# Altium schematic sheet USB.SchDoc: USB_Charger
size A4; Author: Sajitha Madugalle; Revision: 1; SheetNumber: 5; SheetTotal: 7
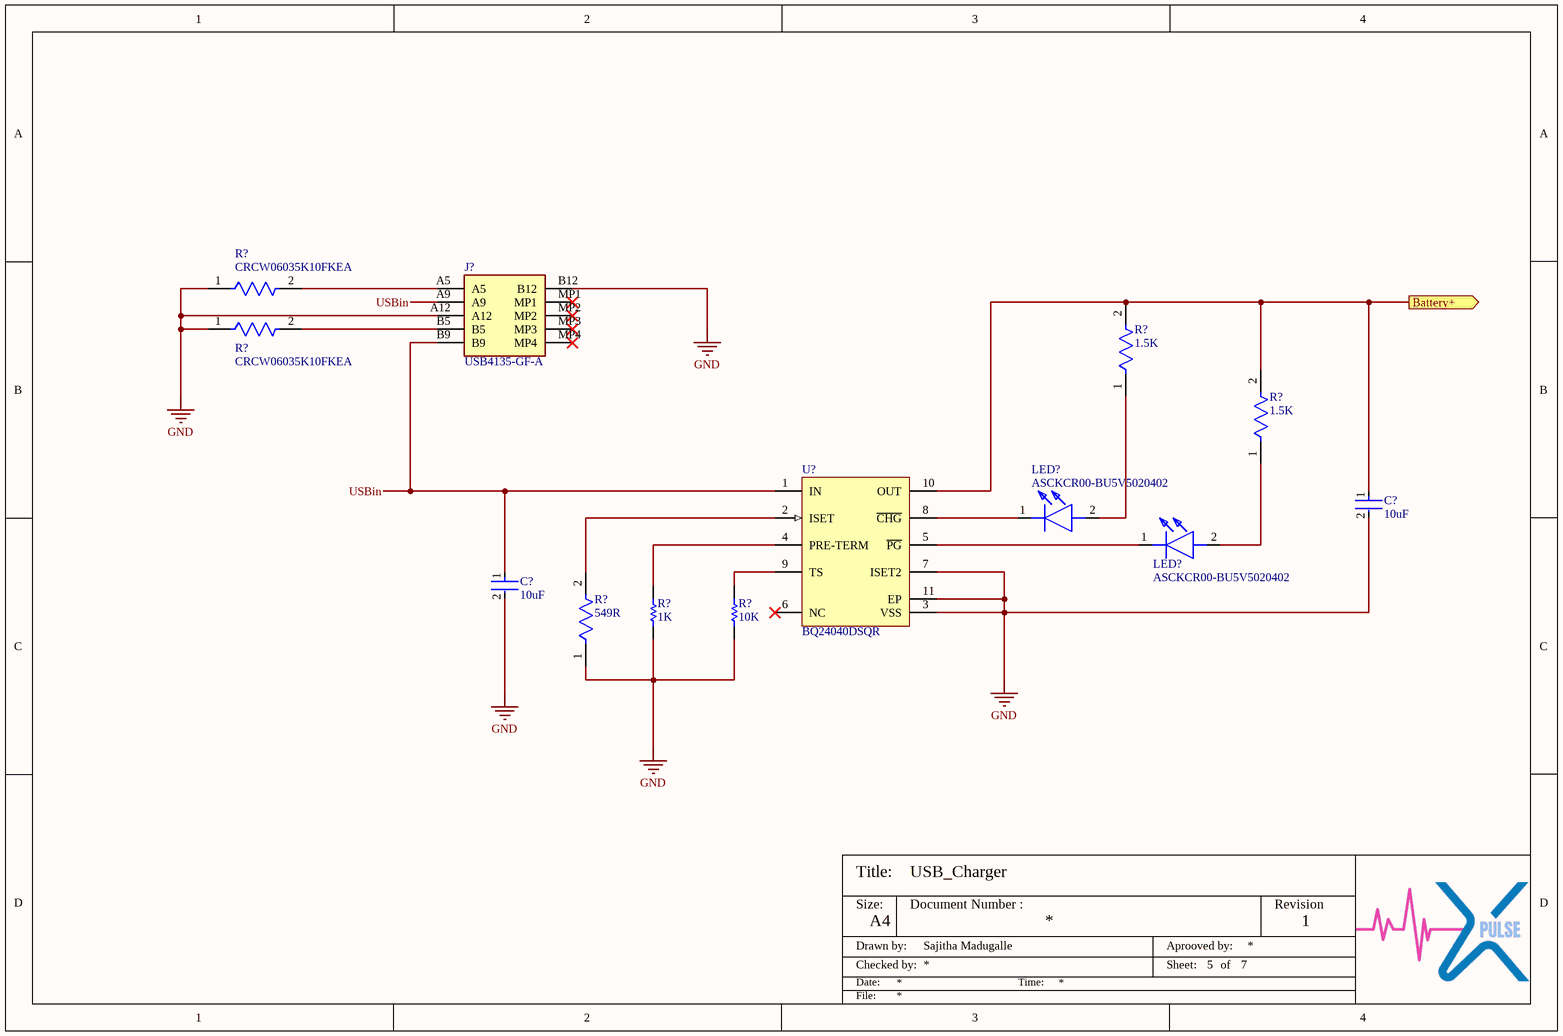
[diagram p0: USB.SchDoc]

## Parts
(Parts that share a designator on the sheet are numbered #1, #2 ... from top to bottom, then left to right.)
C?#1  10uF  [FP-CL10-IPC_A]
C?#2  10uF  [FP-CL10-IPC_A]
J?  USB4135-GF-A  [USB4135GFA]
LED?#1  ASCKCR00-BU5V5020402  [ASCKCR00BU5V5020402]
LED?#2  ASCKCR00-BU5V5020402  [ASCKCR00BU5V5020402]
R?#1  CRCW06035K10FKEA  [FP-CRCW0603-e3-IPC_C]
R?#2  CRCW06035K10FKEA  [FP-CRCW0603-e3-IPC_C]
R?#3  1.5K  [FP-CRCW0603-e3-IPC_A]
R?#4  1.5K  [FP-CRCW0603-e3-IPC_A]
R?#5  1K  [RESC1609X50X30NL8T20]
R?#6  10K  [RESC1609X50X30NL8T20]
R?#7  549R  [FP-CRCW0603-e3-IPC_B]
U?  BQ24040DSQR  [DSQ0010A_V]

## Ports
Battery+ (out)

## Nets
GND: C?#1.2 C?#2.2 J?.A12 J?.B12 R?#1.1 R?#2.1 R?#5.1 R?#6.1 R?#7.1 U?.3(VSS) U?.7(ISET2) U?.11(EP)
Battery+: C?#1.1 R?#3.2 R?#4.2 U?.10(OUT) ; port Battery+
USBin: C?#2.1 J?.A9 J?.B9 U?.1(IN)
NetJ?_A5: J?.A5 R?#1.2
NetJ?_B5: J?.B5 R?#2.2
NetLED?#1_1: LED?#1.1(K) U?.8(~{CHG})
NetLED?#1_2: LED?#1.2(A) R?#3.1
NetLED?#2_1: LED?#2.1(K) U?.5(~{PG})
NetLED?#2_2: LED?#2.2(A) R?#4.1
NetR?#5_2: R?#5.2 U?.4(PRE-TERM)
NetR?#6_2: R?#6.2 U?.9(TS)
NetR?#7_2: R?#7.2 U?.2(ISET)

Not connected (* = marked no-connect by the designer): J? MP1* MP2* MP3* MP4*; U? 6(NC)*

## Notes on the sheet
- Title:
- Size:
- Document Number :
- Revision
- Drawn by:
- Checked by:
- Date:
- A4
- Time:
- Aprooved by:
- Sheet:
- of
- File:

## Library data of the parts
C?#1 C?#2 = CMP-13271-000587-1: Cap Ceramic 100nF 50V X7R ±10% Pad SMD 0603 +125°C T/R; Case/Package: 0603; Depth: 0.8mm; Max Operating Temperature: 125°C; Lead Free: Lead Free; Material: Ceramic; Voltage Rating: 50V; Min Operating Temperature: -55°C; Voltage Rating (DC): 50V; Dielectric: X7R; Height: 0.8mm; Capacitance: 100nF; Thickness: 0.035inch; Radiation Hardening: No; Voltage: 50V; Packaging: Tape and Reel; Length: 1.6mm; Tolerance: 10%; Width: 0.031inch; Mount: Surface Mount; Package Quantity: 10000
J? = USB4135-GF-A: Connector; Manufacturer_Name: GCT (GLOBAL CONNECTOR TECHNOLOGY); Datasheet Link: https://ar.mouser.com/datasheet/2/837/usb4135-2930399.pdf; Height: 3.5mm; Manufacturer_Part_Number: USB4135-GF-A; Mouser Part Number: 640-USB4135-GF-A; Mouser Price/Stock: https://www.mouser.co.uk/ProductDetail/GCT/USB4135-GF-A?qs=Li%252BoUPsLEnt6HRo6RUvaXA%3D%3D
LED?#1 LED?#2 = ASCKCR00-BU5V5020402: LED; Manufacturer_Name: Avago Technologies; Datasheet Link: https://docs.broadcom.com/doc/ASCKCx00-xxxxx0x0x02-DS; Height: 0.75mm; Manufacturer_Part_Number: ASCKCR00-BU5V5020402; Mouser Part Number: 630-ASCKCR00BU5V5020; Mouser Price/Stock: https://www.mouser.co.uk/ProductDetail/Broadcom-Avago/ASCKCR00-BU5V5020402?qs=OcgtsXO%252B3gu355%2FiA8jcWA%3D%3D
R?#1 R?#2 = CMP-1012-00590-3: RES Thick Film, 5.1kΩ, 1%, 0.1W, 100ppm/°C, 0603; Power Rating: 100mW; Voltage Rating (DC): 75V; Resistance: 5.1kR; Width: 0.85mm; Depth: 0.85mm; Military Standard: Not; Package Quantity: 5000; Case Code (Metric): 1608; Length: 1.55mm; Weight: 7.1E-05oz; Packaging: Tape and Reel; Temperature Coefficient: 100ppm/°C; Case Code (Imperial): 0603; Lead Free: Lead Free; Radiation Hardening: No; Contact Plating: Tin; Composition: Thick Film; Max Operating Temperature: 155°C; Termination: SMD/SMT; Case/Package: 0603; Min Operating Temperature: -55°C; Tolerance: 1%; Voltage Rating: 75V; Mount: Surface Mount; Height: 0.45mm
R?#3 R?#4 = CMP-2000-02995-2: RES Thick Film, 1.5kΩ, 1%, 0.1W, 100ppm/°C, 0603; Working Voltage: 75V; Power Rating: 100mW; Resistance: 1.5kR; Max Operating Temperature: 155°C; Features: Automotive AEC-Q200; Min Operating Temperature: -55°C; Width: 0.033inch; Case/Package: 0603; Voltage Rating (DC): 75V; Termination: SMD/SMT; Mount: Surface Mount; Weight: 7.1E-05oz; Case Code (Metric): 1608; Height: 0.45mm; Voltage Rating: 75V; Length: 1.55mm; Package Quantity: 10; Lead Free: Lead Free; Composition: Thick Film; Packaging: Tape and Reel; Temperature Coefficient: 100ppm/°C; Tolerance: 1%; Military Standard: Not; Case Code (Imperial): 0603; Number of Terminations: 2; Max Power Dissipation: 100mW; Depth: 0.85mm; Contact Plating: Tin
R?#5 R?#6 = CMP-1666-00005-4: Chip Resistor, 10 KOhm, +/- 1%, 100 mW, -55 to 155 degC, 0603 (1608 Metric), RoHS, Tape and Reel; Manufacturer: Vishay Semiconductor; Voltage Rating: 75 V; Max Operating Temperature: 155 degC; PackageDescription: 2-Pin Surface Mount Device, Body 1.575 x 0.85 mm; ComponentLink1Description: Manufacturer URL; RoHSCompliant: true; PackageReference: 0603; REACH SVHC: Unknown; Length: 1.55 mm; DatasheetVersion: 06/2012; Packaging: Tape and Reel; Min Operating Temperature: -55 degC; Mounting Technology: Surface Mount; ComponentLink2URL: https://datasheet.ciiva.com/11809/0900766b80d98afc-11809037.pdf; Height: 0.45 mm; ComponentLink2Description: Datasheet; Package Quantity: 5000; ComponentLink1URL: http://www.vishay.com/
R?#7 = CMP-2000-03457-2: RES Thick Film, 549Ω, 1%, 0.1W, 100ppm/°C, 0603; Power Rating: 100mW; Voltage Rating: 75V; Composition: Thick Film; Resistance: 549R; Packaging: Tape and Reel; Max Operating Temperature: 155°C; Features: Automotive AEC-Q200; Temperature Coefficient: 100ppm/°C; Number of Terminations: 2; Radiation Hardening: No; Height: 0.45mm; Min Operating Temperature: -55°C; Width: 0.033inch; Number of Pins: 2; Contact Plating: Tin; Tolerance: 1%; Weight: 7.1E-05oz; Length: 1.55mm; Max Power Dissipation: 100mW; Depth: 0.85mm; Case Code (Metric): 1608; Case Code (Imperial): 0603; Package Quantity: 10; Military Standard: Not; Case/Package: 0603; Termination: SMD/SMT
U? = CMP-0321-00456-2: 800 mA, Single-Input, Single Cell Li-Ion Battery Charger with Auto Start. Vovp=6.6 V, 3.5 V, -40 to 85 degC, 10-pin SON (DSQ), Green (RoHS & no Sb/Br); Manufacturer: Texas Instruments; NiCd: N; Vin(Min)(V): 3.5; SubFamily: Battery Charge Management; PackageDescription: 10-Pin Plastic Small Outline No-Lead, 2 x 2 x 0.8 mm Body, 0.4 mm Pitch, Exposed Pad; PackageVersion: revB, Apr-2010; Mounting Technology: Surface Mount; Eco-Plan: Green (RoHS & no Sb/Br); ComponentLink1URL: http://www.ti.com/general/docs/lit/getliterature.tsp?genericPartNumber=BQ24040&fileType=pdf; PartNumber: BQ24040DSQR; DatasheetVersion: SLUS941A; Over Voltage Protection: N; PackageReference: DSQ0010A; NiMH: N; Li-Ion: N; Lead Acid: N; Li-Polymer: N; ComponentLink1Description: Datasheet